# Altium schematic sheet 06-HDMI_KEY_MARK.SchDoc
size A4; 学校: 辽宁工程技术大学; 考号: 2107010403; 证件号: 532124200305070711; 图号: 第1幅; 图号数: 总共7幅; SheetNumber: 6; SheetTotal: 6; 单位名称: 辽宁工程技术大学; 身份证号: 532124200305070711; 姓名: 邓祥涛; 图名: mydesign; 选手编号: 84011514
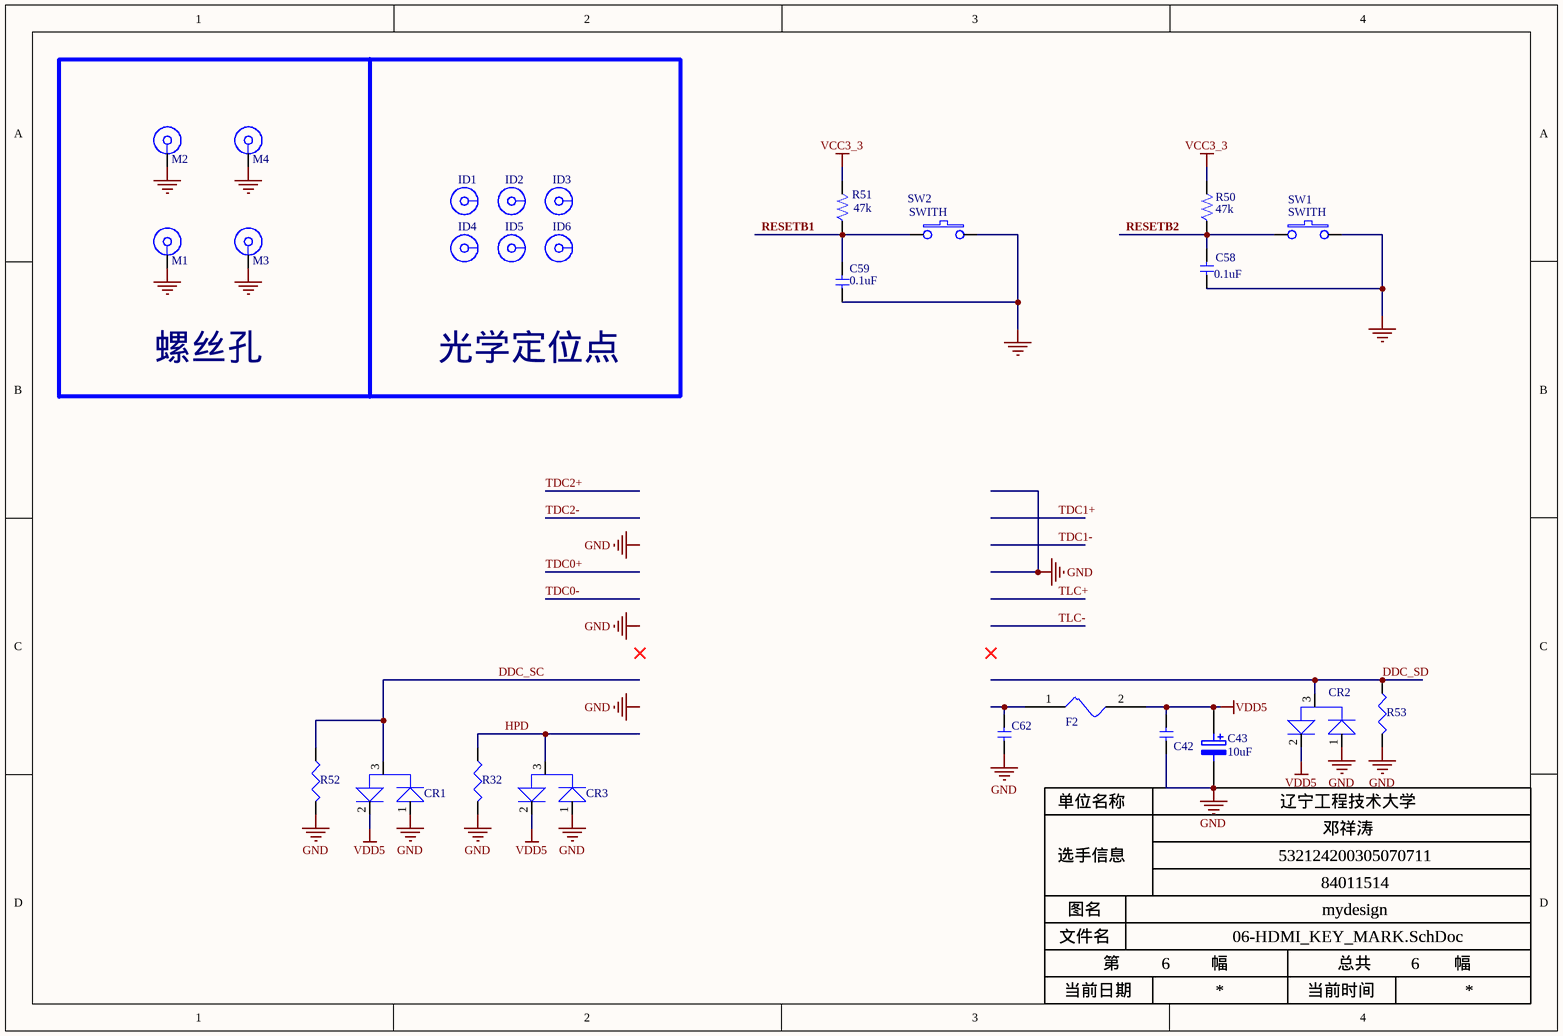
[diagram p0: 06-HDMI_KEY_MARK.SchDoc]

## Parts
C42  C_2  [C0603]  (value not drawn)
C43  10uF  [3528-C]
C58  value 0.1uF  [C0603]  (hidden comment: C_2)
C59  value 0.1uF  [C0603]  (hidden comment: C_2)
C62  C_2  [C0603]  (value not drawn)
CR1  DUALDIODE_1  [SOT-23]  (value not drawn)
CR2  DUALDIODE_1  [SOT-23]  (value not drawn)
CR3  DUALDIODE_1  [SOT-23]  (value not drawn)
F2  FUSE  [1206-F]  (value not drawn)
ID1  HO  [MARKS]  (value not drawn)
ID2  HO  [MARKS]  (value not drawn)
ID3  HO  [MARKS]  (value not drawn)
ID4  HO  [MARKS]  (value not drawn)
ID5  HO  [MARKS]  (value not drawn)
ID6  HO  [MARKS]  (value not drawn)
M1  HO  [MOUNT]  (value not drawn)
M2  HO  [MOUNT]  (value not drawn)
M3  HO  [MOUNT]  (value not drawn)
M4  HO  [MOUNT]  (value not drawn)
R32  R  [R0603]  (value not drawn)
R50  value 47k  [R0603]  (hidden comment: R_3)
R51  value 47k  [R0603]  (hidden comment: R_3)
R52  R  [R0603]  (value not drawn)
R53  R  [R0603]  (value not drawn)
SW1  value SWITH  [SW-280]  (hidden comment: SW_PUSHBUTTON_2)
SW2  value SWITH  [SW-280]  (hidden comment: SW_PUSHBUTTON_2)

## Nets
GND: C42.1 C43.2 C58.1 C59.1 C62.1 CR1.1 CR2.1 CR3.1 M1.1 M2.1 M3.1 M4.1 R32.2 R52.2 R53.2 SW1.2 SW2.2
VCC3_3: R50.2 R51.2
VDD5: C42.2 C43.1 CR1.2 CR2.2 CR3.2 F2.2
DDC_SC: CR1.3 R52.1
DDC_SD: CR2.3 R53.1
HPD: CR3.3 R32.1
RESETB1: C59.2 R51.1 SW2.1
RESETB2: C58.2 R50.1 SW1.1
NetC62_2: C62.2 F2.1

## Notes on the sheet
- 螺丝孔
- 光学定位点
- Labels drawn without touching a wire or pin: GND
- 单位名称
- 选手信息
- 图名
- 文件名
- 当前日期
- 第
- 幅
- 当前时间
- 总共

## Library data of the parts
C42 C62 = C_2: PCB DECAL: 0603; SOURCE_PATH: C:\ORCAD\ORCAD_10.0\TOOLS\CAPTURE\LIBRARY\PSPICE\ANALOG.OLB; VALUE: 0.1u; DIST: FLAT; PSPICETEMPLATE: C^@REFDES %1 %2 ?TOLERANCE|C^@REFDES| @VALUE ?IC/IC=@IC/ ?TOLERANCE|\n.model C^@REFDES CAP C=1 DEV=@TOLERANCE%|; VOLTAGE: CMAX; CURRENT: CIMAX; KNEE: CBMAX; SLOPE: CSMAX; MAX_TEMP: CTMAX
C43 = ELECTRO2: Electrolytic Capacitor
C58 C59 = C_2: PCB DECAL: 0603; SOURCE_PATH: C:\ORCAD\ORCAD_10.0\TOOLS\CAPTURE\LIBRARY\PSPICE\ANALOG.OLB; DIST: FLAT; PSPICETEMPLATE: C^@REFDES %1 %2 ?TOLERANCE|C^@REFDES| @VALUE ?IC/IC=@IC/ ?TOLERANCE|\n.model C^@REFDES CAP C=1 DEV=@TOLERANCE%|; VOLTAGE: CMAX; CURRENT: CIMAX; KNEE: CBMAX; SLOPE: CSMAX; MAX_TEMP: CTMAX
CR1-CR3 = DUALDIODE_1: PARTNAME: BAT54SLT1; SOURCE_PATH: D:\TONGLIU\7306\PCB\REF_CH7306_N_09_02_03_V07.DSN; VALUE: BAT54SLT1; PCB DECAL: SOT-23
F2 = FUSE: PCB DECAL: MINISMDC050CT; SOURCE_PATH: C:\PROGRAM FILES\ORCAD\CAPTURE\LIBRARY\DISCRETE.OLB; VALUE: 050CT-ND
ID1-ID6 M1-M4 = BNC: PCB DECAL: RCA-101; SOURCE_PATH: C:\PROGRAM FILES\印院出品\CAPTURE 16.2\LIBRARY\CONNECTOR.OLB; VALUE: BNC
R32 R52 R53 = R: PCB DECAL: 0603; SOURCE_PATH: M:\BIN\ORCAD95\CAPTURE\LIBRARY\DEVICE.OLB; VALUE: 75
R50 R51 = R_3: PCB DECAL: 0603; SOURCE_PATH: C:\ORCAD\ORCAD_10.0\TOOLS\CAPTURE\LIBRARY\PSPICE\ANALOG.OLB; POWER: RMAX; MAX_TEMP: RTMAX; SLOPE: RSMAX; VOLTAGE: RVMAX; PSPICETEMPLATE: R^@REFDES %1 %2 ?TOLERANCE|R^@REFDES| @VALUE  ?TOLERANCE|\n.model R^@REFDES RES R=1 DEV=@TOLERANCE%|; DIST: FLAT
SW1 SW2 = SW_PUSHBUTTON_2: SOURCE_PATH: C:\PROGRAM FILES\ORCAD\CAPTURE\LIBRARY\DISCRETE.OLB; PCB DECAL: SW-280